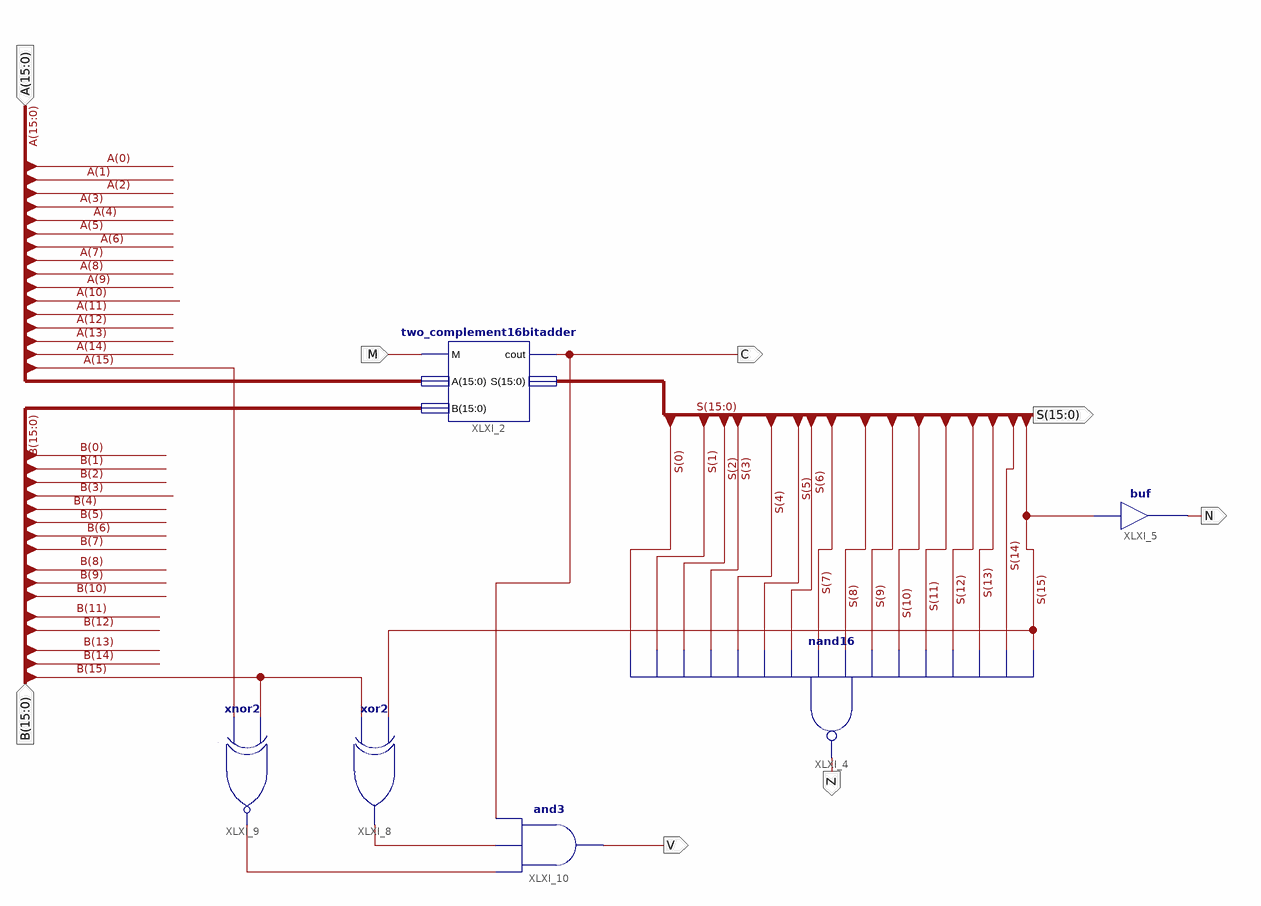
[diagram p0: schematic sheet 1]
// Xilinx ISE schematic ALU.sch (spartan3e) as structural Verilog: 6 symbols, 8 ports
module ALU (
  input  [15:0] B,
  input  [15:0] A,
  input  M,
  output [15:0] S,
  output Z,
  output N,
  output V,
  output C
);

  wire XLXN_89, XLXN_90;

  two_complement16bitadder XLXI_2 (.A(A), .B(B), .cout(C), .M(M), .S(S));
  nand XLXI_4 (Z, S[0], S[1], S[2], S[3], S[4], S[5], S[6], S[7], S[8], S[9], S[10], S[11], S[12], S[13], S[14], S[15]);
  buf XLXI_5 (N, S[15]);
  xor XLXI_8 (XLXN_90, B[15], S[15]);
  xnor XLXI_9 (XLXN_89, A[15], B[15]);
  and XLXI_10 (V, XLXN_89, XLXN_90, C);
endmodule
